# Altium project STM_System_Board.PrjPCB (part 5 of 6)

## Sheet Ethernet.SchDoc
size 420 x 297 mm; Author: G.Kasprowicz, P. Kulik; CompanyName: WUT ISE; DrawnBy: G.Kasprowicz, P. Kulik; Organization: WUT ISE; DocumentNumber: 2; SheetNumber: 2; ModifiedBy: -; CheckedDate: -; Title2: Ethernet; Designer: G.Kasprowicz, P. Kulik; ModifiedDate: -; ProjectName: Sensor Box
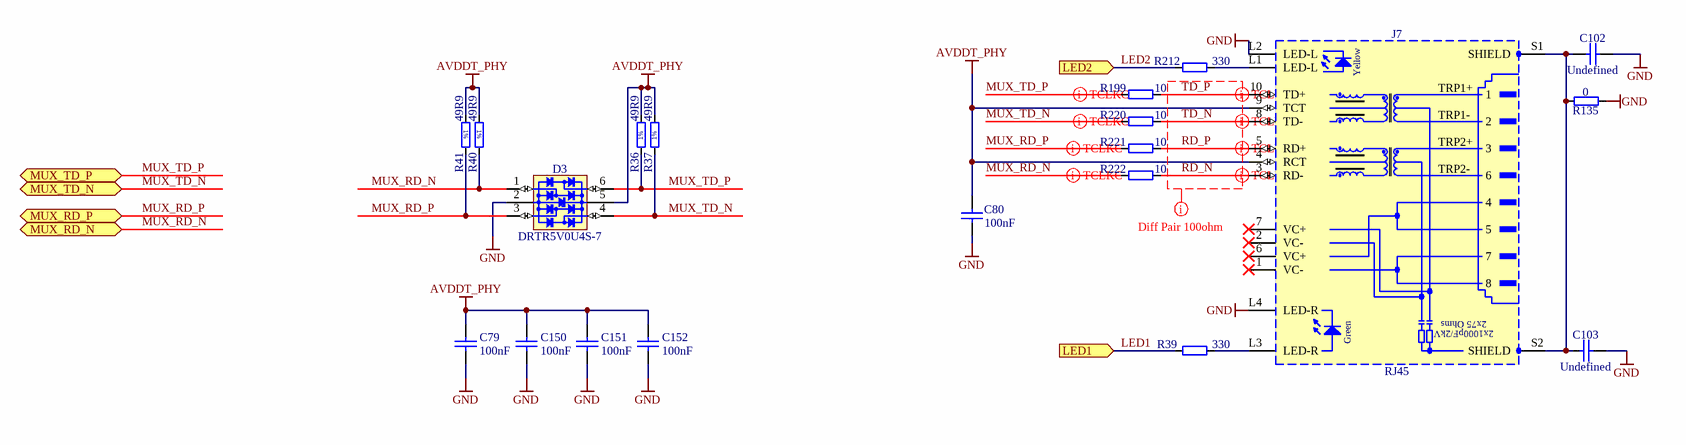
[diagram p9: Ethernet.SchDoc]

### Parts
C79  100nF  [CAPC1005X55N]
C80  100nF  [CAPC1005X55N]
C102  Undefined  [CAPC2012X135N]
C103  Undefined  [CAPC2012X135N]
C150  100nF  [CAPC1005X55N]
C151  100nF  [CAPC1005X55N]
C152  100nF  [CAPC1005X55N]
D3  DRTR5V0U4S-7  [SOT65P210X110-6N]
J7  RJ45  [ABRACON_ARJM11C7-114-BA-EW2]
R36  49R9  [RESC1005X40N]
R37  49R9  [RESC1005X40N]
R39  330  [RESC1005X40N]
R40  49R9  [RESC1005X40N]
R41  49R9  [RESC1005X40N]
R135  0  [RESC1608X55N]
R199  10  [RESC1005X40N]
R212  330  [RESC1005X40N]
R220  10  [RESC1005X40N]
R221  10  [RESC1005X40N]
R222  10  [RESC1005X40N]

### Ports
LED1 (in), LED2 (in), MUX_RD_N (bidir), MUX_RD_P (bidir), MUX_TD_N (bidir), MUX_TD_P (bidir)

### Nets
AVDDT_PHY: C79.1 C80.2 C150.1 C151.1 C152.1 D3.5(VBUS) J7.4(RCT) J7.9(TCT) R36.2 R37.2 R40.1 R41.1
GND: C79.2 C80.1 C102.2 C103.2 C150.2 C151.2 C152.2 D3.2(GND) J7.L2(LED-L) J7.L4(LED-R) R135.1
LED1: R39.1 ; port LED1
LED2: R212.1 ; port LED2
MUX_RD_N: D3.1(I/O1) R40.2 R222.1 ; port MUX_RD_N
MUX_RD_P: D3.3(I/O2) R41.2 R221.1 ; port MUX_RD_P
MUX_TD_N: D3.4(I/O3) R37.1 R220.1 ; port MUX_TD_N
MUX_TD_P: D3.6(I/O4) R36.1 R199.1 ; port MUX_TD_P
RD_N: J7.3(RD-) R222.2
RD_P: J7.5(RD+) R221.2
TD_N: J7.8(TD-) R220.2
TD_P: J7.10(TD+) R199.2
NetC102_1: C102.1 C103.1 J7.S1(SHIELD) J7.S2(SHIELD) R135.2
NetJ7_L1: J7.L1(LED-L) R212.2
NetJ7_L3: J7.L3(LED-R) R39.2

Not connected (* = marked no-connect by the designer): J7 1(VC-)* 2(VC-)* 6(VC+)* 7(VC+)*

### Layout directives
differential pair: MUX_RD_N, MUX_RD_P, MUX_TD_N, MUX_TD_P, RD_N, RD_P, TD_N, TD_P
mark named Diff Pair 100ohm: RD_N, RD_P, TD_N, TD_P

### Notes on the sheet
- Project/Equipment
- Document
- Designer
- Drawn by
- Check.by
- Copyright WUT =Copy(CurrentDate,7,4)
  This document describes Open Hardware and is licensed under the CERN-OHL-W v2
  You may redistribute and modify this documentation and make products using it under the terms of the CERN-OHL-W v2 (https:/cern.ch/cern-ohl). This documentation is distributed WITHOUT ANY EXPRESS OR IMPLIED WARRANTY, INCLUDING OF MERCHANTABILITY, SATISFACTORY QUALITY AND FITNESS FOR A PARTICULAR PURPOSE. Please see the CERN-OHL-W v2 for applicable conditions.
  Source location: =SourceLocation
  As per CERN-OHL-W v2 section 4, should You produce hardware based on these sources, You must maintain the Source Location visible on the silkscreen or top copper for a =Title1 PCB or other product you make using this documentation.
- Contact:
- File
- Last Mod.
- Print Date
- Sheet
- Size
- A3
- of
- Rev
- (in symbol CON_ETH_POE_ARJM11C7) Yellow; TRP1+; TRP1-; TRP2+; TRP2-; 2x75 Ohms; Green; 2x1000pF/2kV
- (in symbol R0402_49R9_1%_0.0625W_100PPM) 1%

### Library data of the parts
C79 C80 C150-C152 = CC0402_100NF_16V_10%_X5R: Non-polarised capacitor; Part Description: SMD Multilayer Chip Ceramic Capacitor; Manufacturer: GENERIC; Manufacturer1 Part Number: GRM155R61C104KA88D; Voltage: 16V; TC: X5R; Tolerance: ±10%; Part Number: CC0402_100NF_16V_10%_X5R; Component Kind: Standard; Component Type: Standard; Pin Count: 2; Value: 100nF; Status: None; Manufacturer Part Number: CC0402_100NF_16V_10%_X5R; Case: 0402; Mounted: Yes; Socket: No; SMD: Yes; Manufacturer1 Example: MURATA; Manufacturer1 ComponentHeight: 0.55mm; HelpURL: \\cern.ch\dfs\Applications\Altium\Datasheets\CC0402_X5R_MURATA_GRM.pdf; Author: CERN DEM JLC; CreateDate: 10.12.2013; LatestRevisionDate: 10.12.2013; Sense: No
C102 C103 = CC0805_NO-VALUE: Non-polarised capacitor; Part Description: Reserved Footprint For 0805(2012) Chip Ceramic Capacitor; Mounted: No; Part Number: CC0805_NO-VALUE; Component Kind: Standard; Component Type: Standard; Pin Count: 2; Value: Undefined; Status: None; Manufacturer: Undefined; Manufacturer Part Number: CC0805_NO-VALUE; Case: 0805; Socket: No; SMD: Yes; Sense: No; Manufacturer1 ComponentHeight: 1.35mm; HelpURL: Undefined; Author: CERN DEM JLC; CreateDate: 10.12.2008; LatestRevisionDate: 11.09.2013
D3 = D_TVS_DRTR5V0U4S-7: Integrated Quad Ultra-Low Capacitance ESD Protection; Part Description: Integrated Quad Ultra-Low Capacitance ESD (±8kV) Protection; Manufacturer: DIODES; PressFit: No; Bonding: No; Status Comment: Active; Part Number: DRTR5V0U4S-7; Component Kind: Standard; Component Type: Standard; Device: DRTR5V0U4S-7; PackageDescription: SOT363, SC70-6, 0.65mm Pitch; 6 Pin, 1.25mm W X 2.00mm L X 1.10mm H body, IPC Medium Density; Status: Active; Manufacturer Part Number: DRTR5V0U4S-7; Pin Count: 6; Case: SOT363; Mounted: Yes; Socket: No; SMD: Yes; Sense: No; ComponentHeight: 1.1mm; HelpURL: \\cern.ch\dfs\Applications\Altium\Datasheets\PRTR5V0U4Y.pdf; Author: GK; CreateDate: 24.01.2017; LatestRevisionDate: 14.09.2020
J7 = CON_ETH_POE_ARJM11C7: MagJack 10/100BaseT, PoE+, 1X1, OG/Y, -40 to 85*C, Tab Up, RoHS; Part Number: ARJM11C7-114-BA-EW2; Part Description: 1 Port, Orange Green/Yellow LEDs, RJ45 10/100BaseT, PoE, Ethernet MagJack® Connector Module; Manufacturer: Abracon; PressFit: No; Component Kind: Standard; Component Type: Standard; Pin Count: 18; Family: RJ45; Mounted: Yes; Socket: No; SMD: No; Sense: No; Status: None; Manufacturer Part Number: ARJM11C7-114-BA-EW2; ComponentHeight: 13.61mm; HelpURL: \\cern.ch\dfs\Applications\Altium\Datasheets\BELFUSE_0826-1X1T-GJ-F.pdf; Author: GK; CreateDate: 05.11.2012; LatestRevisionDate: 05.11.2012
R36 R37 R40 R41 = R0402_49R9_1%_0.0625W_100PPM: Resistor - 1%; Part Description: General Purpose Thick Film Chip Resistor; Manufacturer: GENERIC; Manufacturer1 Part Number: 232270674999L or RC0402FR-0749R9L; TC: ±100ppm/°C; Table: Resistors SMD; Part Number: R0402_49R9_1%_0.0625W_100PPM; Component Kind: Standard; Component Type: Standard; Pin Count: 2; Value: 49R9; Status: Not recommended; Power: 0.0625W; Tolerance: ±1%; Manufacturer Part Number: R0402_49R9_1%_0.0625W_100PPM; Case: 0402; Mounted: Yes; Socket: No; SMD: Yes; Manufacturer1 Example: YAGEO PHYCOMP; Manufacturer1 ComponentHeight: 0.4mm; HelpURL: \\cern.ch\dfs\Applications\Altium\Datasheets\R0402_Phycomp_RC0402.pdf; Author: CERN DEM JLC; CreateDate: 2012-10-24; LatestRevisionDate: 2012-10-24
R39 R212 = R0402_330R_1%_0.0625W_100PPM: Resistor - 1%; Part Description: General Purpose Thick Film Chip Resistor; Manufacturer: GENERIC; Manufacturer1 Part Number: 232270673301L; TC: ±100ppm/°C; PressFit: No; Part Number: R0402_330R_1%_0.0625W_100PPM; Component Kind: Standard; Component Type: Standard; Pin Count: 2; Value: 330; Status: Not Recommended; Power: 0.0625W; Tolerance: ±1%; Manufacturer Part Number: R0402_330R_1%_0.0625W_100PPM; Case: 0402; Mounted: Yes; Sense: No; Socket: No; SMD: Yes; Manufacturer1 Example: YAGEO PHYCOMP; Manufacturer1 ComponentHeight: 0.4mm; HelpURL: \\cern.ch\dfs\Applications\Altium\Datasheets\R0402_Phycomp_RC0402.pdf; Author: CERN DEM JLC; CreateDate: 03.12.2007; LatestRevisionDate: 17.10.2012
R135 = R0603_0R_JUMPER: Resistor; Part Description: 1A (0.05R Max DC Resistance) Zero Ohm Jumper; Manufacturer: GENERIC; Manufacturer1 Part Number: NRC06Z0; PressFit: No; Part Number: R0603_0R_JUMPER; Component Kind: Standard; Component Type: Standard; Pin Count: 2; Value: 0; Status: Preferred; Manufacturer Part Number: R0603_0R_JUMPER; Case: 0603; Mounted: Yes; Sense: No; Socket: No; SMD: Yes; Manufacturer1 Example: NIC COMPONENT; Manufacturer1 ComponentHeight: 0.55mm; HelpURL: \\cern.ch\dfs\Applications\Altium\Datasheets\R0603_NIC_NRC.pdf; Author: CERN DEM JLC; CreateDate: 03.12.2007; LatestRevisionDate: 13.03.2008
R199 R220-R222 = R0402_10R_1%_0.0625W_200PPM: Resistor - 1%; Part Description: General Purpose Thick Film Chip Resistor; Manufacturer: GENERIC; Manufacturer1 Part Number: 232270671009L; TC: ±200ppm/°C; PressFit: No; Part Number: R0402_10R_1%_0.0625W_200PPM; Component Kind: Standard; Component Type: Standard; Pin Count: 2; Value: 10; Status: Not Recommended; Power: 0.0625W; Tolerance: ±1%; Manufacturer Part Number: R0402_10R_1%_0.0625W_200PPM; Case: 0402; Mounted: Yes; Sense: No; Socket: No; SMD: Yes; Manufacturer1 Example: YAGEO PHYCOMP; Manufacturer1 ComponentHeight: 0.4mm; HelpURL: \\cern.ch\dfs\Applications\Altium\Datasheets\R0402_Phycomp_RC0402.pdf; Author: CERN DEM JLC; CreateDate: 24.06.2009; LatestRevisionDate: 17.10.2012

## Sheet ST_SYS_Board_Config.schdoc
size 420 x 297 mm; EDA_Number: ARTIQ; Author: G.Kasprowicz; CompanyName: WUT ISE; DrawnBy: G.Kasprowicz; Organization: WUT ISE; DocumentNumber: 12; SheetNumber: 12; ModifiedBy: -; CheckedDate: -; Title2: Configuration; Designer: G.Kasprowicz; ModifiedDate: -; ProjectName: Sensor Box
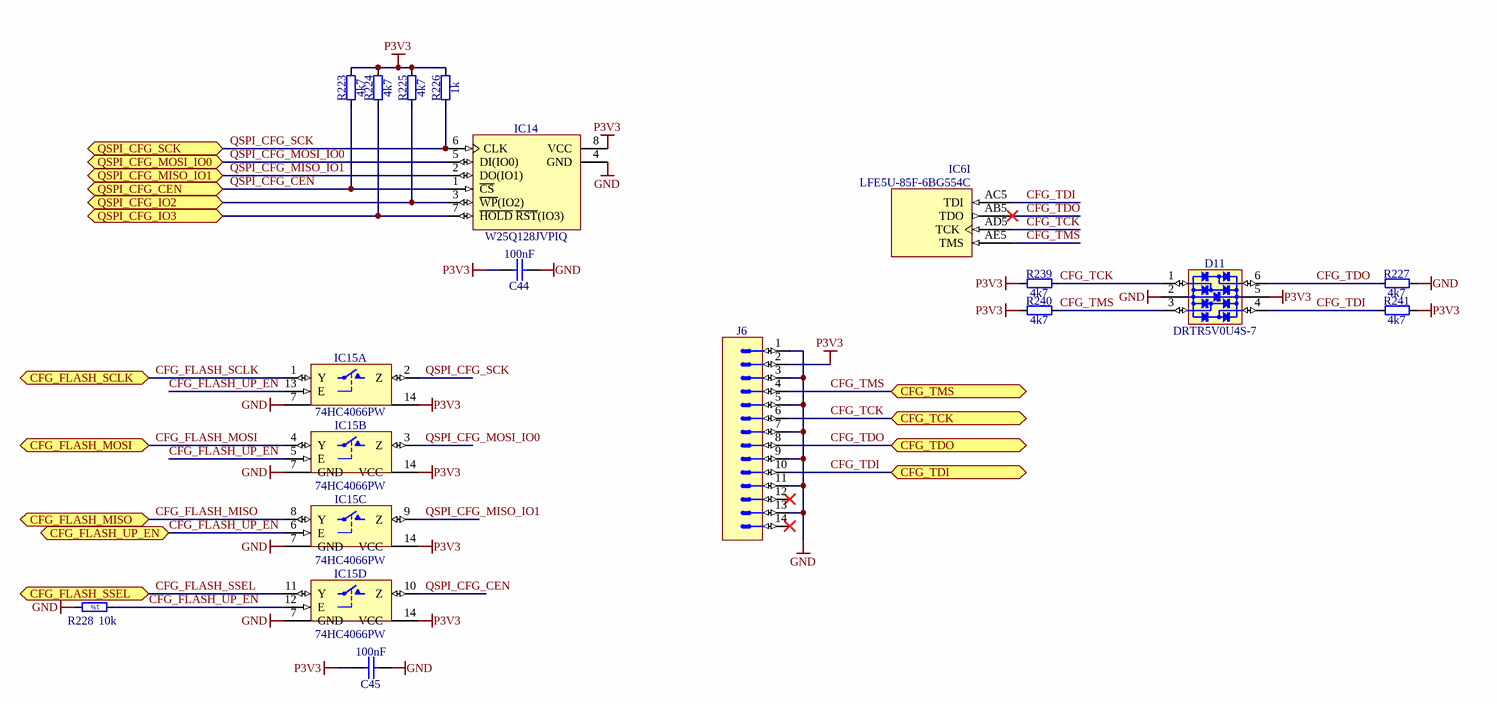
[diagram p10: ST_SYS_Board_Config.schdoc]

### Parts
C44  100nF  [CAPC1005X55N]
C45  100nF  [CAPC1005X55N]
D11  DRTR5V0U4S-7  [SOT65P210X110-6N]
IC6  LFE5U-85F-6BG554C  [BGA554C80P26X26_2300X2300X176]  (part I of 15)
IC14  W25Q128JVPIQ  [SON127P600X500X80-9N-R345X435]
IC15  74HC4066PW  [SOP65P640X110-14N]  (parts A,B,C,D of 4)
J6  Milli-Grid™  [MOLEX_87832-1420]  (value not drawn)
R223  4k7  [RESC1005X40N]
R224  4k7  [RESC1005X40N]
R225  4k7  [RESC1005X40N]
R226  1k  [RESC1005X40N]
R227  4k7  [RESC1005X40N]
R228  10k  [RESC1005X40N]
R239  4k7  [RESC1005X40N]
R240  4k7  [RESC1005X40N]
R241  4k7  [RESC1005X40N]

### Ports
CFG_FLASH_MISO (bidir), CFG_FLASH_MOSI (bidir), CFG_FLASH_SCLK (bidir), CFG_FLASH_SSEL (bidir), CFG_FLASH_UP_EN (bidir), CFG_TCK (bidir), CFG_TDI (bidir), CFG_TDO (bidir), CFG_TMS (bidir), QSPI_CFG_CEN (bidir), QSPI_CFG_IO2 (bidir), QSPI_CFG_IO3 (bidir), QSPI_CFG_MISO_IO1 (bidir), QSPI_CFG_MOSI_IO0 (bidir), QSPI_CFG_SCK (bidir)

### Nets
GND: C44.1 C45.1 D11.2(GND) IC14.4(GND) IC15.7(GND) J6.1 J6.3 J6.5 J6.7 J6.9 J6.11 J6.13 R227.2 R228.2
P3V3: C44.2 C45.2 D11.5(VBUS) IC14.8(VCC) IC15.14(VCC) J6.2 R223.2 R224.2 R225.2 R226.2 R239.1 R240.1 R241.2
CFG_FLASH_MISO: IC15.8(Y) ; port CFG_FLASH_MISO
CFG_FLASH_MOSI: IC15.4(Y) ; port CFG_FLASH_MOSI
CFG_FLASH_SCLK: IC15.1(Y) ; port CFG_FLASH_SCLK
CFG_FLASH_SSEL: IC15.11(Y) ; port CFG_FLASH_SSEL
CFG_FLASH_UP_EN: IC15.5(E) IC15.6(E) IC15.12(E) IC15.13(E) R228.1 ; port CFG_FLASH_UP_EN
CFG_TCK: D11.1(I/O1) IC6.AD5(TCK) J6.6 R239.2 ; port CFG_TCK
CFG_TDI: D11.4(I/O3) IC6.AC5(TDI) J6.10 R241.1 ; port CFG_TDI
CFG_TDO: D11.6(I/O4) IC6.AB5(TDO) J6.8 R227.1 ; port CFG_TDO
CFG_TMS: D11.3(I/O2) IC6.AE5(TMS) J6.4 R240.2 ; port CFG_TMS
QSPI_CFG_CEN: IC14.1(~{CS}) IC15.10(Z) R223.1 ; port QSPI_CFG_CEN
QSPI_CFG_IO2: IC14.3(~{WP}(IO2)) R225.1 ; port QSPI_CFG_IO2
QSPI_CFG_IO3: IC14.7(~{HOLD}_~{RST}(IO3)) R224.1 ; port QSPI_CFG_IO3
QSPI_CFG_MISO_IO1: IC14.2(DO(IO1)) IC15.9(Z) ; port QSPI_CFG_MISO_IO1
QSPI_CFG_MOSI_IO0: IC14.5(DI(IO0)) IC15.3(Z) ; port QSPI_CFG_MOSI_IO0
QSPI_CFG_SCK: IC14.6(CLK) IC15.2(Z) R226.1 ; port QSPI_CFG_SCK

Not connected (* = marked no-connect by the designer): J6 12* 14*

### Notes on the sheet
- Project/Equipment
- Document
- Designer
- Drawn by
- Check.by
- Copyright WUT =Copy(CurrentDate,7,4)
  This document describes Open Hardware and is licensed under the CERN-OHL-W v2
  You may redistribute and modify this documentation and make products using it under the terms of the CERN-OHL-W v2 (https:/cern.ch/cern-ohl). This documentation is distributed WITHOUT ANY EXPRESS OR IMPLIED WARRANTY, INCLUDING OF MERCHANTABILITY, SATISFACTORY QUALITY AND FITNESS FOR A PARTICULAR PURPOSE. Please see the CERN-OHL-W v2 for applicable conditions.
  Source location: =SourceLocation
  As per CERN-OHL-W v2 section 4, should You produce hardware based on these sources, You must maintain the Source Location visible on the silkscreen or top copper for a =Title1 PCB or other product you make using this documentation.
- Contact:
- File
- Last Mod.
- Print Date
- Sheet
- Size
- A3
- of
- Rev
- (in symbol R0402_10K_1%_0.0625W_100PPM) 1%

### Library data of the parts
C44 C45 = CC0402_100NF_16V_10%_X5R: as C79 on sheet Ethernet; Part Number: CC0402_100NF_16V_10%_X5R; Component Kind: Standard; Component Type: Standard; Pin Count: 2; Value: 100nF; Status: None; Manufacturer Part Number: CC0402_100NF_16V_10%_X5R; Case: 0402; Mounted: Yes; Socket: No; SMD: Yes; Sense: No; Manufacturer1 Example: MURATA; Manufacturer1 ComponentHeight: 0.55mm; HelpURL: \\cern.ch\dfs\Applications\Altium\Datasheets\CC0402_X5R_MURATA_GRM.pdf; Author: CERN DEM JLC; CreateDate: 10.12.2013; LatestRevisionDate: 10.12.2013
D11 = D_TVS_DRTR5V0U4S-7: as D3 on sheet Ethernet; Part Number: DRTR5V0U4S-7; Component Kind: Standard; Component Type: Standard; Device: DRTR5V0U4S-7; PackageDescription: SOT363, SC70-6, 0.65mm Pitch; 6 Pin, 1.25mm W X 2.00mm L X 1.10mm H body, IPC Medium Density; Status: Active; Manufacturer Part Number: DRTR5V0U4S-7; Pin Count: 6; Case: SOT363; Mounted: Yes; Socket: No; SMD: Yes; Sense: No; ComponentHeight: 1.1mm; HelpURL: \\cern.ch\dfs\Applications\Altium\Datasheets\PRTR5V0U4Y.pdf; Author: GK; CreateDate: 24.01.2017; LatestRevisionDate: 14.09.2020
IC6 = LFE5U-85F-6BG554C: Part Description: FPGA LatticeECP5 Family 84000 Cells 40nm Technology 1.1V 554-Pin CABGA Tray; Manufacturer: LATTICE SEMICONDUCTOR; PressFit: No; Bonding: No; Part Number: LFE5U-85F-6BG554C; Component Kind: Standard; Component Type: Standard; Device: LFE5U-85F-6BG554C; PackageDescription: BGA, 0.80mm Pitch, Square; 554Pin, 26 Columns X 26 Rows, 23mm X 23mm X 1.76mm H; Manufacturer Part Number: LFE5U-85F-6BG554C; Pin Count: 554; Case: BGA554; Mounted: Yes; Socket: No; SMD: Yes; Sense: No; ComponentHeight: 1.76mm; HelpURL: \\cern.ch\dfs\Applications\Altium\Datasheets\LFE5U-85F-6BG554C.pdf; ComponentLink1URL: \\cern.ch\dfs\Applications\Altium\Datasheets\LATTICE_Package.pdf; ComponentLink1Description: Package Drawing; ComponentLink2URL: \\cern.ch\dfs\Applications\Altium\Datasheets\LFE5U-85F-6BG554C_Pinout.pdf; ComponentLink2Description: Pinout; Author: CERN DEM HF; CreateDate: 18.02.2022; LatestRevisionDate: 18.02.2022
IC14 = W25Q128JVPIQ: 128M-bit Serial Flash Memory with uniform 4KB sectors and Dual/Quad SPI and QPI; Manufacturer: WINBOND; PressFit: No; Bonding: No; Part Number: W25Q128JVPIQ; Component Kind: Standard; Component Type: Standard; Device: W25Q128JVPIQ; PackageDescription: SON, 1.27mm Pitch; 8 Pin, 6.00mm W X 5.00mm L X 0.8mm H body (w/Thermal Tab 3.45mm x 4.35mm); Part Description: 128M-bit Serial Flash Memory with uniform 4KB sectors and Dual/Quad SPI and QPI; Manufacturer Part Number: W25Q128JVPIQ; Pin Count: 9; Case: SON8; Mounted: Yes; Socket: No; SMD: Yes; Sense: No; ComponentHeight: 0.8mm; HelpURL: \\cern.ch\dfs\Applications\Altium\Datasheets\W25Q128JVPIQ.pdf; Author: CERN DEM BC; CreateDate: 24.01.2019; LatestRevisionDate: 24.01.2019
IC15 = 74HC4066PW: Part Description: Quad Single-Pole Single-Throw Analog Switch; Manufacturer: NXP SEMICONDUCTORS; PressFit: No; Bonding: No; Table: Standard Logic; Part Number: 74HC4066PW; Component Kind: Standard; Component Type: Standard; Device: 74HC4066PW; PackageDescription: SOP, 14-Leads, Body 4.4x5mm (max), Pitch 0.65mm, IPC Medium Density; Manufacturer Part Number: 74HC4066PW; Pin Count: 14; Case: TSSOP14; Mounted: Yes; Socket: No; SMD: Yes; ComponentHeight: 1.1mm; Author: CERN DEM JLC; HelpURL: \\cern.ch\dfs\Applications\Altium\Datasheets\74HC4066PW.pdf; CreateDate: 2014-11-19; LatestRevisionDate: 2014-11-19
J6 = MOLEX_87832-1420: Connector 14 Male; Part Description: 2.00mm (.079") Pitch Milli-Grid™ Header, Surface Mount, Vertical, Shrouded, 14 Circuits,with Locking Windows and Centre Polarization Slot, PCB Locator; Manufacturer: MOLEX; PressFit: No; Part Number: MOLEX_87832-1420; Component Kind: Standard; Component Type: Standard; Pin Count: 14; Family: Milli-Grid™; Mounted: Yes; Socket: No; SMD: Yes; Sense: No; Status: None; Manufacturer Part Number: 87832-1420; ComponentHeight: 7.6mm; HelpURL: \\cern.ch\dfs\Applications\Altium\Datasheets\MOLEX_87832-1420.pdf; Author: CERN DEM JLC; CreateDate: 09.09.2008; LatestRevisionDate: 09.09.2008
R223-R225 R227 R239-R241 = R0402_4k7_1%_0.0625W_100PPM: Resistor - 1%; Part Description: General Purpose Thick Film Chip Resistor; Manufacturer: GENERIC; Manufacturer1 Part Number: 232270674702L; TC: ±100ppm/°C; PressFit: No; Part Number: R0402_4K7_1%_0.0625W_100PPM; Component Kind: Standard; Component Type: Standard; Pin Count: 2; Value: 4k7; Status: Not Recommended; Power: 0.0625W; Tolerance: ±1%; Manufacturer Part Number: R0402_4K7_1%_0.0625W_100PPM; Case: 0402; Mounted: Yes; Sense: No; Socket: No; SMD: Yes; Manufacturer1 Example: YAGEO PHYCOMP; Manufacturer1 ComponentHeight: 0.4mm; HelpURL: \\cern.ch\dfs\Applications\Altium\Datasheets\R0402_Phycomp_RC0402.pdf; Author: CERN DEM JLC; CreateDate: 03.12.2007; LatestRevisionDate: 17.10.2012
R226 = R0402_1k_1%_0.0625W_100PPM: Resistor - 1%; Part Description: General Purpose Thick Film Chip Resistor; Manufacturer: GENERIC; Manufacturer1 Part Number: 232270671002L; TC: ±100ppm/°C; PressFit: No; Part Number: R0402_1K_1%_0.0625W_100PPM; Component Kind: Standard; Component Type: Standard; Pin Count: 2; Value: 1k; Status: Not Recommended; Power: 0.0625W; Tolerance: ±1%; Manufacturer Part Number: R0402_1K_1%_0.0625W_100PPM; Case: 0402; Mounted: Yes; Sense: No; Socket: No; SMD: Yes; Manufacturer1 Example: YAGEO PHYCOMP; Manufacturer1 ComponentHeight: 0.4mm; HelpURL: \\cern.ch\dfs\Applications\Altium\Datasheets\R0402_Phycomp_RC0402.pdf; Author: CERN DEM JLC; CreateDate: 03.12.2007; LatestRevisionDate: 17.10.2012
R228 = R0402_10K_1%_0.0625W_100PPM: Resistor - 1%; Part Description: General Purpose Thick Film Chip Resistor; Manufacturer: GENERIC; Manufacturer1 Part Number: 232270671003L; TC: ±100ppm/°C; Table: Resistors SMD; Part Number: R0402_10K_1%_0.0625W_100PPM; Component Kind: Standard; Component Type: Standard; Pin Count: 2; Value: 10k; Status: Not recommended; Power: 0.0625W; Tolerance: ±1%; Manufacturer Part Number: R0402_10K_1%_0.0625W_100PPM; Case: 0402; Mounted: Yes; Socket: No; SMD: Yes; Manufacturer1 Example: YAGEO PHYCOMP; Manufacturer1 ComponentHeight: 0.4mm; HelpURL: \\cern.ch\dfs\Applications\Altium\Datasheets\R0402_Phycomp_RC0402.pdf; Author: CERN DEM JLC; CreateDate: 2007-12-03; LatestRevisionDate: 2012-10-17

## Sheet ST_SYS_Board_Clocking.schdoc
size 420 x 297 mm; EDA_Number: ARTIQ; Author: G.Kasprowicz; CompanyName: WUT ISE; DrawnBy: G.Kasprowicz; Organization: WUT ISE; DocumentNumber: 13; SheetNumber: 13; ModifiedBy: -; CheckedDate: -; Title2: Clock distribution; Designer: G.Kasprowicz; ModifiedDate: -; ProjectName: Sensor Box
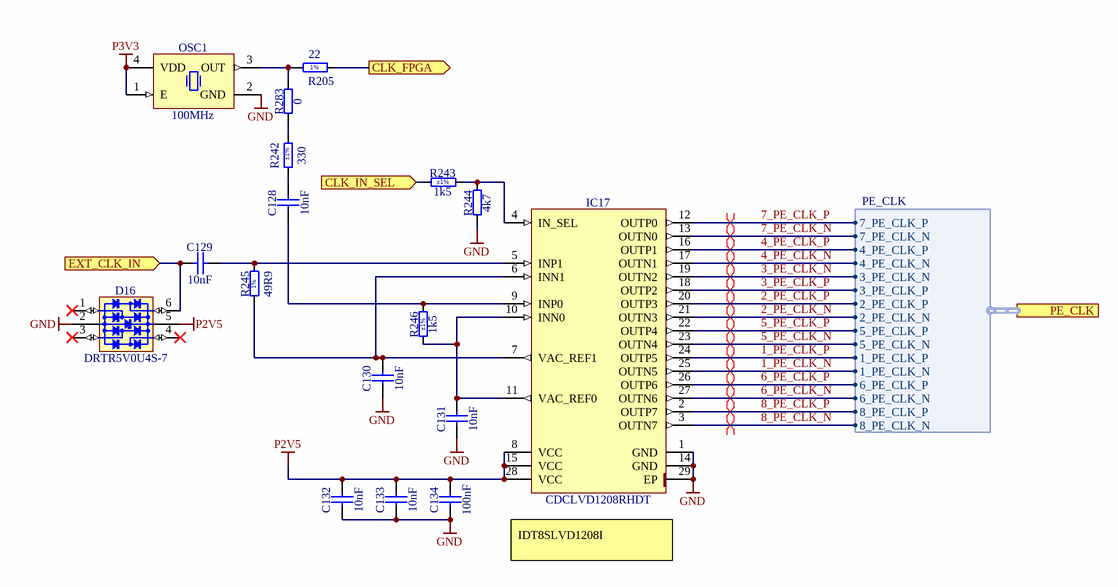
[diagram p11: ST_SYS_Board_Clocking.schdoc]

### Parts
C128  10nF  [CAPC0603X33N]
C129  10nF  [CAPC0603X33N]
C130  10nF  [CAPC0603X33N]
C131  10nF  [CAPC0603X33N]
C132  10nF  [CAPC0603X33N]
C133  10nF  [CAPC0603X33N]
C134  100nF  [CAPC1005X55N]
D16  DRTR5V0U4S-7  [SOT65P210X110-6N]
IC17  CDCLVD1208RHDT  [QFN50P500X500X100-29N-S325]
OSC1  100MHz  [OSC_ECS_ECS-3953M]
R205  22  [RESC1005X40N]
R242  330  Tolerance: ±1%  [RESC1005X40N]
R243  1k5  Tolerance: ±1%  [RESC1005X40N]
R244  4k7  [RESC1005X40N]
R245  49R9  [RESC1005X40N]
R246  1k5  Tolerance: ±1%  [RESC1005X40N]
R283  0  [RESC1005X40N]

### Ports
CLK_FPGA (out), CLK_IN_SEL (in), EXT_CLK_IN (in), PE_CLK (harness PE_CLK)

### Harnesses
PE_CLK: 1_PE_CLK_P, 1_PE_CLK_N, 2_PE_CLK_P, 2_PE_CLK_N, 3_PE_CLK_P, 3_PE_CLK_N, 4_PE_CLK_P, 4_PE_CLK_N, 5_PE_CLK_P, 5_PE_CLK_N, 6_PE_CLK_P, 6_PE_CLK_N, 7_PE_CLK_P, 7_PE_CLK_N, 8_PE_CLK_P, 8_PE_CLK_N

### Nets
GND: C130.1 C131.1 C132.1 C133.1 C134.1 D16.2(GND) IC17.1(GND) IC17.14(GND) IC17.29(EP) OSC1.2(GND) R244.1
P2V5: C132.2 C133.2 C134.2 D16.5(VBUS) IC17.8(VCC) IC17.15(VCC) IC17.28(VCC)
P3V3: OSC1.1(E) OSC1.4(VDD)
1_PE_CLK_N: IC17.25(OUTN5) ; port PE_CLK.1_PE_CLK_N
1_PE_CLK_P: IC17.24(OUTP5) ; port PE_CLK.1_PE_CLK_P
2_PE_CLK_N: IC17.21(OUTN3) ; port PE_CLK.2_PE_CLK_N
2_PE_CLK_P: IC17.20(OUTP3) ; port PE_CLK.2_PE_CLK_P
3_PE_CLK_N: IC17.19(OUTN2) ; port PE_CLK.3_PE_CLK_N
3_PE_CLK_P: IC17.18(OUTP2) ; port PE_CLK.3_PE_CLK_P
4_PE_CLK_N: IC17.17(OUTN1) ; port PE_CLK.4_PE_CLK_N
4_PE_CLK_P: IC17.16(OUTP1) ; port PE_CLK.4_PE_CLK_P
5_PE_CLK_N: IC17.23(OUTN4) ; port PE_CLK.5_PE_CLK_N
5_PE_CLK_P: IC17.22(OUTP4) ; port PE_CLK.5_PE_CLK_P
6_PE_CLK_N: IC17.27(OUTN6) ; port PE_CLK.6_PE_CLK_N
6_PE_CLK_P: IC17.26(OUTP6) ; port PE_CLK.6_PE_CLK_P
7_PE_CLK_N: IC17.13(OUTN0) ; port PE_CLK.7_PE_CLK_N
7_PE_CLK_P: IC17.12(OUTP0) ; port PE_CLK.7_PE_CLK_P
8_PE_CLK_N: IC17.3(OUTN7) ; port PE_CLK.8_PE_CLK_N
8_PE_CLK_P: IC17.2(OUTP7) ; port PE_CLK.8_PE_CLK_P
CLK_FPGA: R205.2 ; port CLK_FPGA
CLK_IN_SEL: R243.1 ; port CLK_IN_SEL
NetC128_1: C128.1 IC17.9(INP0) R246.2
NetC128_2: C128.2 R242.1
NetC129_1: C129.1 D16.6(I/O4) ; port EXT_CLK_IN
NetC129_2: C129.2 IC17.5(INP1) R245.2
NetC130_2: C130.2 IC17.6(INN1) IC17.7(VAC_REF1) R245.1
NetC131_2: C131.2 IC17.10(INN0) IC17.11(VAC_REF0) R246.1
NetIC17_4: IC17.4(IN_SEL) R243.2 R244.2
NetOSC1_3: OSC1.3(OUT) R205.1 R283.2
NetR242_2: R242.2 R283.1

Not connected (* = marked no-connect by the designer): D16 1(I/O1)* 3(I/O2)* 4(I/O3)*

### Layout directives
differential pair; differential pair class PE_CLK: 1_PE_CLK_N, 1_PE_CLK_P, 2_PE_CLK_N, 2_PE_CLK_P, 3_PE_CLK_N, 3_PE_CLK_P, 4_PE_CLK_N, 4_PE_CLK_P, 5_PE_CLK_N, 5_PE_CLK_P, 6_PE_CLK_N, 6_PE_CLK_P, 7_PE_CLK_N, 7_PE_CLK_P, 8_PE_CLK_N, 8_PE_CLK_P

### Notes on the sheet
- IDT8SLVD1208I
- Project/Equipment
- Document
- Designer
- Drawn by
- Check.by
- Copyright WUT =Copy(CurrentDate,7,4)
  This document describes Open Hardware and is licensed under the CERN-OHL-W v2
  You may redistribute and modify this documentation and make products using it under the terms of the CERN-OHL-W v2 (https:/cern.ch/cern-ohl). This documentation is distributed WITHOUT ANY EXPRESS OR IMPLIED WARRANTY, INCLUDING OF MERCHANTABILITY, SATISFACTORY QUALITY AND FITNESS FOR A PARTICULAR PURPOSE. Please see the CERN-OHL-W v2 for applicable conditions.
  Source location: =SourceLocation
  As per CERN-OHL-W v2 section 4, should You produce hardware based on these sources, You must maintain the Source Location visible on the silkscreen or top copper for a =Title1 PCB or other product you make using this documentation.
- Contact:
- File
- Last Mod.
- Print Date
- Sheet
- Size
- A3
- of
- Rev
- (in symbol R0402_22R_1%_0.0625W_100PPM) 1%
- (in symbol R0402_49R9_1%_0.0625W_100PPM) 1%

### Library data of the parts
C128-C133 = CC0201_10NF_10V_10%_X5R: Non-polarised capacitor; Part Description: SMD Multilayer Chip Ceramic Capacitor; Manufacturer: GENERIC; Manufacturer1 Part Number: 0201ZD103KAT2A; Voltage: 10V; TC: X5R; Tolerance: ±10%; Part Number: CC0201_10NF_10V_10%_X5R; Component Kind: Standard; Component Type: Standard; Pin Count: 2; Value: 10nF; Status: Not Recommended; Manufacturer Part Number: CC0201_10NF_10V_10%_X5R; Case: 0201; Mounted: Yes; Socket: No; SMD: Yes; Sense: No; Manufacturer1 Example: AVX; Manufacturer1 ComponentHeight: 0.33mm; HelpURL: \\cern.ch\dfs\Applications\Altium\Datasheets\CC0201_X5R_AVX.pdf; Author: CERN DEM JLC; CreateDate: 03.12.2007; LatestRevisionDate: 03.12.2007
C134 = CC0402_100NF_16V_10%_X5R: as C79 on sheet Ethernet; Part Number: CC0402_100NF_16V_10%_X5R; Component Kind: Standard; Component Type: Standard; Pin Count: 2; Value: 100nF; Status: None; Manufacturer Part Number: CC0402_100NF_16V_10%_X5R; Case: 0402; Mounted: Yes; Socket: No; SMD: Yes; Sense: No; Manufacturer1 Example: MURATA; Manufacturer1 ComponentHeight: 0.55mm; HelpURL: \\cern.ch\dfs\Applications\Altium\Datasheets\CC0402_X5R_MURATA_GRM.pdf; Author: CERN DEM JLC; CreateDate: 10.12.2013; LatestRevisionDate: 10.12.2013
D16 = D_TVS_DRTR5V0U4S-7: as D3 on sheet Ethernet; Part Number: DRTR5V0U4S-7; Component Kind: Standard; Component Type: Standard; Device: DRTR5V0U4S-7; PackageDescription: SOT363, SC70-6, 0.65mm Pitch; 6 Pin, 1.25mm W X 2.00mm L X 1.10mm H body, IPC Medium Density; Status: Active; Manufacturer Part Number: DRTR5V0U4S-7; Pin Count: 6; Case: SOT363; Mounted: Yes; Socket: No; SMD: Yes; Sense: No; ComponentHeight: 1.1mm; HelpURL: \\cern.ch\dfs\Applications\Altium\Datasheets\PRTR5V0U4Y.pdf; Author: GK; CreateDate: 24.01.2017; LatestRevisionDate: 14.09.2020
IC17 = CDCLVD1208RHDT: 2:8 Low Additive Jitter LVDS Buffer; Manufacturer: TEXAS INSTRUMENTS; PressFit: No; Bonding: No; Part Number: CDCLVD1208RHDT; Component Kind: Standard; Component Type: Standard; Device: CDCLVD1208RHDT; PackageDescription: QFN, 0.50mm Pitch, Square; 28 pin, 5.00mm L X 5.00mm W X 1.00mm H body (w/Thermal Tab 3.25 X 3.25mm), IPC Medium Density; Part Description: 2:8 Low Additive Jitter LVDS Buffer; Manufacturer Part Number: CDCLVD1208RHD; Pin Count: 29; Case: QFN28; Mounted: Yes; Socket: No; SMD: Yes; Sense: No; ComponentHeight: 1mm; HelpURL: \\cern.ch\dfs\Applications\Altium\Datasheets\CDCLVD1208RHDT.pdf; Author: CERN DEM JLC; CreateDate: 28.06.2012; LatestRevisionDate: 10.06.2022
OSC1 = OSC_100MHZ_ECS_ECS-3953M-1000-BN: Oscillator 4 pins 1=E/D 2=GND 3=OUT 4=VDD; Part Description: 3.3V, ±50ppm, 15pF, -40 to 85°C, Surface Mount Clock Oscillator (ECS-3951M/3953M-BN Series); Manufacturer: ECS; PressFit: No; Bonding: No; Part Number: OSC_100MHZ_ECS_ECS-3953M-1000-BN; Component Kind: Standard; Component Type: Standard; PackageDescription: SMD Oscillator, 4 pins, 7 x 5mm, ECS-3951/3953M-BN Series; Value: 100MHz; Manufacturer Part Number: ECS-3953M-1000-BN; Pin Count: 4; Mounted: Yes; Socket: No; SMD: Yes; Sense: No; ComponentHeight: 1.7mm; HelpURL: \\cern.ch\dfs\Applications\Altium\Datasheets\OSC_ECS_ECS-3953M-BN.pdf; Author: CERN DEM BC; CreateDate: 07.05.2020; LatestRevisionDate: 07.05.2020
R205 = R0402_22R_1%_0.0625W_100PPM: Resistor - 1%; Part Description: General Purpose Thick Film Chip Resistor; Manufacturer: GENERIC; Manufacturer1 Part Number: 232270672209L; TC: ±100ppm/°C; PressFit: No; Part Number: R0402_22R_1%_0.0625W_100PPM; Component Kind: Standard; Component Type: Standard; Pin Count: 2; Value: 22; Status: Not Recommended; Power: 0.0625W; Tolerance: ±1%; Manufacturer Part Number: R0402_22R_1%_0.0625W_100PPM; Case: 0402; Mounted: Yes; Socket: No; SMD: Yes; Manufacturer1 Example: YAGEO PHYCOMP; Manufacturer1 ComponentHeight: 0.4mm; HelpURL: \\cern.ch\dfs\Applications\Altium\Datasheets\R0402_Phycomp_RC0402.pdf; Author: CERN DEM JLC; CreateDate: 03.12.2007; LatestRevisionDate: 17.10.2012; Sense: No
R242 = R0402_330R_1%_0.0625W_100PPM: as R39 on sheet Ethernet; Part Number: R0402_330R_1%_0.0625W_100PPM; Component Kind: Standard; Component Type: Standard; Pin Count: 2; Value: 330; Status: Not Recommended; Power: 0.0625W; Manufacturer Part Number: R0402_330R_1%_0.0625W_100PPM; Case: 0402; Mounted: Yes; Sense: No; Socket: No; SMD: Yes; Manufacturer1 Example: YAGEO PHYCOMP; Manufacturer1 ComponentHeight: 0.4mm; HelpURL: \\cern.ch\dfs\Applications\Altium\Datasheets\R0402_Phycomp_RC0402.pdf; Author: CERN DEM JLC; CreateDate: 03.12.2007; LatestRevisionDate: 17.10.2012
R243 R246 = R0402_1K5_1%_0.0625W_100PPM: Resistor - 1%; Part Description: General Purpose Thick Film Chip Resistor; Manufacturer: GENERIC; Manufacturer1 Part Number: 232270671502L; TC: ±100ppm/°C; PressFit: No; Part Number: R0402_1K5_1%_0.0625W_100PPM; Component Kind: Standard; Component Type: Standard; Pin Count: 2; Value: 1k5; Status: Not Recommended; Power: 0.0625W; Manufacturer Part Number: R0402_1K5_1%_0.0625W_100PPM; Case: 0402; Mounted: Yes; Sense: No; Socket: No; SMD: Yes; Manufacturer1 Example: YAGEO PHYCOMP; Manufacturer1 ComponentHeight: 0.4mm; HelpURL: \\cern.ch\dfs\Applications\Altium\Datasheets\R0402_Phycomp_RC0402.pdf; Author: CERN DEM JLC; CreateDate: 03.12.2007; LatestRevisionDate: 17.10.2012
R244 = R0402_4k7_1%_0.0625W_100PPM: as R223-R225 on sheet ST_SYS_Board_Config; Part Number: R0402_4K7_1%_0.0625W_100PPM; Component Kind: Standard; Component Type: Standard; Pin Count: 2; Value: 4k7; Status: Not Recommended; Power: 0.0625W; Tolerance: ±1%; Manufacturer Part Number: R0402_4K7_1%_0.0625W_100PPM; Case: 0402; Mounted: Yes; Sense: No; Socket: No; SMD: Yes; Manufacturer1 Example: YAGEO PHYCOMP; Manufacturer1 ComponentHeight: 0.4mm; HelpURL: \\cern.ch\dfs\Applications\Altium\Datasheets\R0402_Phycomp_RC0402.pdf; Author: CERN DEM JLC; CreateDate: 03.12.2007; LatestRevisionDate: 17.10.2012
R245 = R0402_49R9_1%_0.0625W_100PPM: as R36 on sheet Ethernet; Part Number: R0402_49R9_1%_0.0625W_100PPM; Component Kind: Standard; Component Type: Standard; Pin Count: 2; Value: 49R9; Status: Not recommended; Power: 0.0625W; Tolerance: ±1%; Manufacturer Part Number: R0402_49R9_1%_0.0625W_100PPM; Case: 0402; Mounted: Yes; Socket: No; SMD: Yes; Manufacturer1 Example: YAGEO PHYCOMP; Manufacturer1 ComponentHeight: 0.4mm; HelpURL: \\cern.ch\dfs\Applications\Altium\Datasheets\R0402_Phycomp_RC0402.pdf; Author: CERN DEM JLC; CreateDate: 2012-10-24; LatestRevisionDate: 2012-10-24
R283 = R0402_0R_JUMPER: Resistor; Part Description: 1A (0.05R Max DC Resistance) Zero Ohm Jumper; Manufacturer: GENERIC; Manufacturer1 Part Number: 232270591001L; PressFit: No; Part Number: R0402_0R_JUMPER; Component Kind: Standard; Component Type: Standard; Pin Count: 2; Value: 0; Status: Not Recommended; Manufacturer Part Number: R0402_0R_JUMPER; Case: 0402; Mounted: Yes; Sense: No; Socket: No; SMD: Yes; Manufacturer1 Example: YAGEO PHYCOMP; Manufacturer1 ComponentHeight: 0.4mm; HelpURL: \\cern.ch\dfs\Applications\Altium\Datasheets\R0402_Phycomp_RC0402.pdf; Author: CERN DEM JLC; CreateDate: 03.12.2007; LatestRevisionDate: 17.10.2012

## Sheet RMII.SchDoc
size 420 x 297 mm; Author: G.Kasprowicz, P. Kulik; CompanyName: WUT ISE; DrawnBy: G.Kasprowicz, P. Kulik; Organization: WUT ISE; DocumentNumber: 2; SheetNumber: 2; ModifiedBy: -; CheckedDate: -; Title2: Ethernet; Designer: G.Kasprowicz, P. Kulik; ModifiedDate: -; ProjectName: Sensor Box
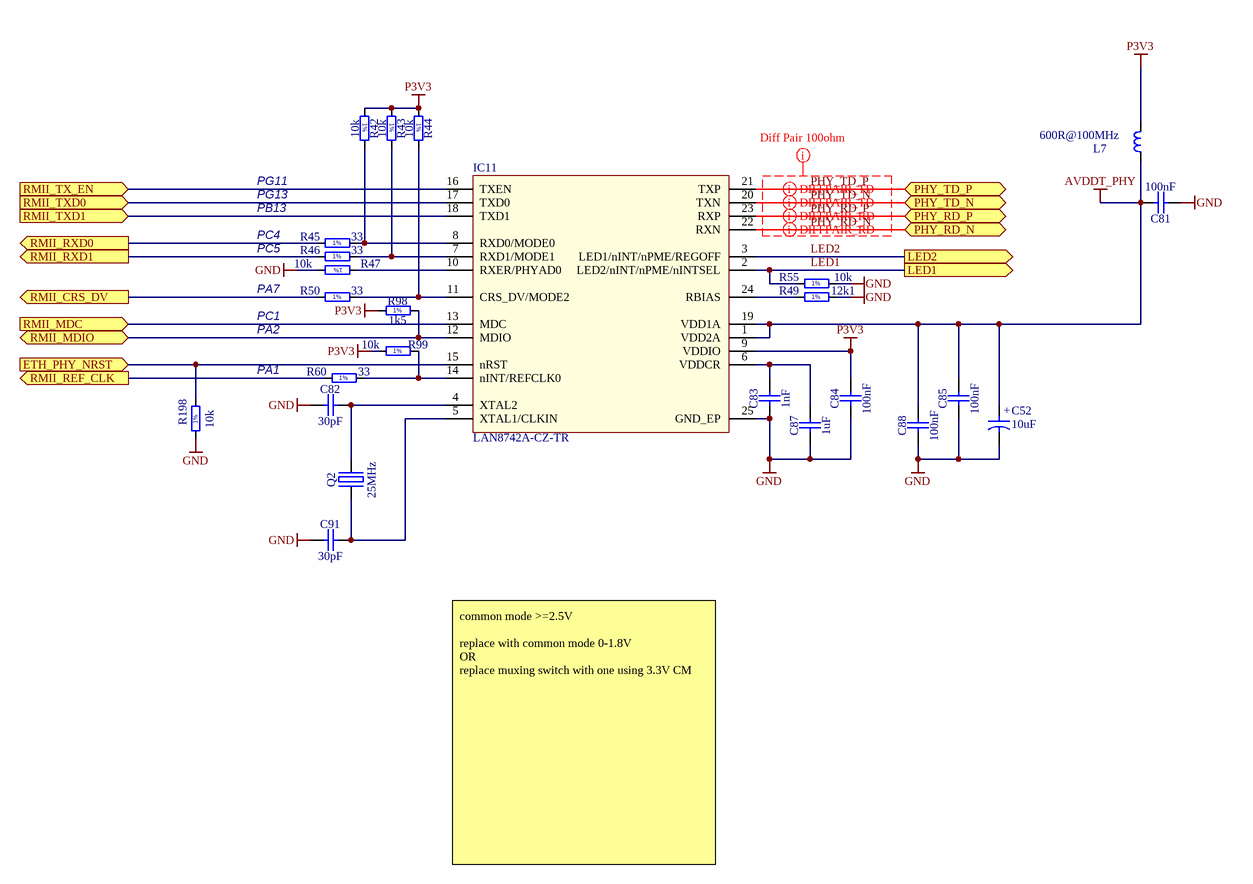
[diagram p12: RMII.SchDoc]

### Parts
C52  10uF  [CAPMP3216X180N]
C81  100nF  [CAPC1005X55N]
C82  30pF  [CAPC1005X55N]
C83  1nF  [CAPC1005X55N]
C84  100nF  [CAPC1005X55N]
C85  100nF  [CAPC1005X55N]
C87  1uF  [CAPC1608X87N]
C88  100nF  [CAPC1005X55N]
C91  30pF  [CAPC1005X55N]
IC11  LAN8742A-CZ-TR  [QFN24_0R5_4X4]
L7  600R@100MHz  [INDC1005X55N]
Q2  25MHz  [XTAL_ABRACON_ABLS]
R42  10k  [RESC1005X40N]
R43  10k  [RESC1005X40N]
R44  10k  [RESC1005X40N]
R45  33  [RESC1005X40N]
R46  33  [RESC1005X40N]
R47  10k  [RESC1005X40N]
R49  12k1  [RESC1005X40N]
R50  33  [RESC1005X40N]
R55  10k  [RESC1005X40N]
R60  33  [RESC1005X40N]
R98  1k5  [RESC1005X40N]
R99  10k  [RESC1005X40N]
R198  10k  [RESC1005X40N]

### Ports
ETH_PHY_NRST (in), LED1 (out), LED2 (out), PHY_RD_N (bidir), PHY_RD_P (bidir), PHY_TD_N (bidir), PHY_TD_P (bidir), RMII_CRS_DV (out), RMII_MDC (in), RMII_MDIO (bidir), RMII_REF_CLK (out), RMII_RXD0 (out), RMII_RXD1 (out), RMII_TX_EN (in), RMII_TXD0 (in), RMII_TXD1 (in)

### Nets
AVDDT_PHY: C52.1 C81.2 C85.2 C88.2 IC11.1(VDD2A) IC11.19(VDD1A) L7.1
GND: C52.2 C81.1 C82.1 C83.1 C84.1 C85.1 C87.1 C88.1 C91.1 IC11.25(GND_EP) R47.2 R49.2 R55.2 R198.1
P3V3: C84.2 IC11.9(VDDIO) L7.2 R42.1 R43.1 R44.1 R98.1 R99.1
ETH_PHY_NRST: IC11.15(nRST) R198.2 ; port ETH_PHY_NRST
LED1: IC11.2(LED2/nINT/nPME/nINTSEL) R55.1 ; port LED1
LED2: IC11.3(LED1/nINT/nPME/REGOFF) ; port LED2
PHY_RD_N: IC11.22(RXN) ; port PHY_RD_N
PHY_RD_P: IC11.23(RXP) ; port PHY_RD_P
PHY_TD_N: IC11.20(TXN) ; port PHY_TD_N
PHY_TD_P: IC11.21(TXP) ; port PHY_TD_P
NetC82_2: C82.2 IC11.4(XTAL2) Q2.2(OSC2)
NetC83_2: C83.2 C87.2 IC11.6(VDDCR)
NetC91_2: C91.2 IC11.5(XTAL1/CLKIN) Q2.1(OSC1)
NetIC9_27: IC11.13(MDC) ; port RMII_MDC
NetIC9_35: R60.1 ; port RMII_REF_CLK
NetIC9_36: IC11.12(MDIO) R98.2 ; port RMII_MDIO
NetIC9_43: R50.1 ; port RMII_CRS_DV
NetIC9_44: R45.1 ; port RMII_RXD0
NetIC9_45: R46.1 ; port RMII_RXD1
NetIC9_70: IC11.16(TXEN) ; port RMII_TX_EN
NetIC9_74: IC11.18(TXD1) ; port RMII_TXD1
NetIC9_128: IC11.17(TXD0) ; port RMII_TXD0
NetIC11_7: IC11.7(RXD1/MODE1) R43.2 R46.2
NetIC11_8: IC11.8(RXD0/MODE0) R42.2 R45.2
NetIC11_10: IC11.10(RXER/PHYAD0) R47.1
NetIC11_11: IC11.11(CRS_DV/MODE2) R44.2 R50.2
NetIC11_14: IC11.14(nINT/REFCLK0) R60.2 R99.2
NetIC11_24: IC11.24(RBIAS) R49.1

### Layout directives
differential pair: PHY_RD_N, PHY_RD_P, PHY_TD_N, PHY_TD_P
mark named Diff Pair 100ohm: PHY_RD_N, PHY_RD_P, PHY_TD_N, PHY_TD_P

### Notes on the sheet
- PG11
- PG13
- PB13
- PC4
- PC5
- PA7
- PC1
- PA2
- PA1
- common mode >=2.5V
  replace with common mode 0-1.8V
  OR
  replace muxing switch with one using 3.3V CM
- Project/Equipment
- Document
- Designer
- Drawn by
- Check.by
- Copyright WUT =Copy(CurrentDate,7,4)
  This document describes Open Hardware and is licensed under the CERN-OHL-W v2
  You may redistribute and modify this documentation and make products using it under the terms of the CERN-OHL-W v2 (https:/cern.ch/cern-ohl). This documentation is distributed WITHOUT ANY EXPRESS OR IMPLIED WARRANTY, INCLUDING OF MERCHANTABILITY, SATISFACTORY QUALITY AND FITNESS FOR A PARTICULAR PURPOSE. Please see the CERN-OHL-W v2 for applicable conditions.
  Source location: =SourceLocation
  As per CERN-OHL-W v2 section 4, should You produce hardware based on these sources, You must maintain the Source Location visible on the silkscreen or top copper for a =Title1 PCB or other product you make using this documentation.
- Contact:
- File
- Last Mod.
- Print Date
- Sheet
- Size
- A3
- of
- Rev
- (in symbol CTE3216-18_10UF_16V_20%_AVX_TCJ) +
- (in symbol R0402_1K5_1%_0.0625W_100PPM) 1%
- (in symbol R0402_10K_1%_0.0625W_100PPM) 1%
- (in symbol R0402_12K1_1%_0.0625W_100PPM) 1%
- (in symbol R0402_33R_1%_0.0625W_100PPM) 1%

### Library data of the parts
C52 = CTE3216-18_10UF_16V_20%_AVX_TCJ: Polarised capacitor; Part Description: ESR 0R200 Tantalum Solid Electrolytic Chip Capacitor with Conductive Polymer Electrode; Manufacturer: AVX; Manufacturer Part Number: TCJA106M016R0200; Voltage: 16V; Tolerance: ±20%; Part Number: CTE3216-18_10UF_16V_20%_AVX_TCJ; Component Kind: Standard; Component Type: Standard; Pin Count: 2; Value: 10uF; Status: Preferred; Case: A; Mounted: Yes; Socket: No; SMD: Yes; Sense: No; ComponentHeight: 1.8mm; HelpURL: \\cern.ch\dfs\Applications\Altium\Datasheets\CTE_AVX_TCJ.pdf; Author: CERN DEM JLC; CreateDate: 29.03.2012; LatestRevisionDate: 29.03.2012
C81 C84 C85 C88 = CC0402_100NF_16V_10%_X5R: as C79 on sheet Ethernet; Value: 100nF; Part Number: CC0402_100NF_16V_10%_X5R; Component Kind: Standard; Component Type: Standard; Pin Count: 2; Status: None; Manufacturer Part Number: CC0402_100NF_16V_10%_X5R; Case: 0402; Mounted: Yes; Socket: No; SMD: Yes; Sense: No; Manufacturer1 Example: MURATA; Manufacturer1 ComponentHeight: 0.55mm; HelpURL: \\cern.ch\dfs\Applications\Altium\Datasheets\CC0402_X5R_MURATA_GRM.pdf; Author: CERN DEM JLC; CreateDate: 10/12/2013; LatestRevisionDate: 10/12/2013
C82 C91 = CC0402_30PF_50V_1%_C0G_MURATA_GJM1555C1H300FB01: Non-polarised capacitor; Part Description: High-Q SMD Chip Monolithic Ceramic Capacitor; Manufacturer: MURATA; Manufacturer Part Number: GJM1555C1H300FB01D; Voltage: 50V; TC: C0G/NP0; Tolerance: ±1%; Part Number: CC0402_30PF_50V_1%_C0G_MURATA_GJM1555C1H300FB01; Component Kind: Standard; Component Type: Standard; Pin Count: 2; Value: 30pF; Status: Not Recommended; Case: 0402; Mounted: Yes; Socket: No; SMD: Yes; Sense: No; ComponentHeight: 0.55mm; HelpURL: \\cern.ch\dfs\Applications\Altium\Datasheets\CC0402_MURATA_GJM1555C1H300FB01D.pdf; Author: CERN DEM BC; CreateDate: 20/11/2017; LatestRevisionDate: 20/11/2017
C83 = CC0402_1NF_50V_10%_X7R: Non-polarised capacitor; Part Description: SMD Multilayer Chip Ceramic Capacitor; Manufacturer: GENERIC; Manufacturer1 Part Number: 223858715623; Voltage: 50V; TC: X7R; Tolerance: ±10%; Part Number: CC0402_1NF_50V_10%_X7R; Component Kind: Standard; Component Type: Standard; Pin Count: 2; Value: 1nF; Status: Not Recommended; Manufacturer Part Number: CC0402_1NF_50V_10%_X7R; Case: 0402; Mounted: Yes; Socket: No; SMD: Yes; Sense: No; Manufacturer1 Example: PHYCOMP; Manufacturer1 ComponentHeight: 0.55mm; HelpURL: \\cern.ch\dfs\Applications\Altium\Datasheets\CC0402_X7R_PHYCOMP.pdf; Author: CERN DEM JLC; CreateDate: 03/12/2007; LatestRevisionDate: 03/12/2007
C87 = CC0603_1UF_16V_10%_X7R: Non-polarised capacitor; Part Description: SMD Multilayer Chip Ceramic Capacitor; Manufacturer: GENERIC; Manufacturer1 Part Number: 223878615663; Voltage: 16V; TC: X7R; Tolerance: ±10%; Part Number: CC0603_1UF_16V_10%_X7R; Component Kind: Standard; Component Type: Standard; Pin Count: 2; Value: 1uF; Status: None; Manufacturer Part Number: CC0603_1uF_16V_10%_X7R; Case: 0603; Mounted: Yes; Socket: No; SMD: Yes; Sense: No; Manufacturer1 Example: YAGEO PHYCOMP; Manufacturer1 ComponentHeight: 0.9mm; HelpURL: \\cern.ch\dfs\Applications\Altium\Datasheets\CC0603_X7R_PHYCOMP.pdf; Author: CERN DEM JLC; CreateDate: 03/12/2007; LatestRevisionDate: 17/04/2015
IC11 = IFC_LAN8742A: LAN8742A-CZ-TR - Small Footprint RMII 10/100 Ethernet, Transceiver with HP Auto-MDIX and flexPWR Technology SQFN-24; Manufacturer: MICROCHIP; Order: LAN8742A-CZ-TR; Manufacturer Part Number: LAN8742A-CZ-TR; Distrib: MICROCHIP
L7 = IND0402_MURATA_BLM15HD601SN1: Inductor; Part Description: SMD EMIFIL Suppression Chip Ferrite Bead; Manufacturer: MURATA; Manufacturer Part Number: BLM15HD601SN1D; Power: 300mA; Resistance: 0.85R; Tolerance: ±25%; Part Number: IND0402_MURATA_BLM15HD601SN1; Component Kind: Standard; Component Type: Standard; Pin Count: 2; Value: 600R@100MHz; Status: None; Case: 0402; Mounted: Yes; Socket: No; SMD: Yes; Sense: No; ComponentHeight: 0.55mm; HelpURL: \\cern.ch\dfs\Applications\Altium\Datasheets\IND0402_MURATA_BLM15H.pdf; Author: CERN DEM JLC; CreateDate: 28/02/2012; LatestRevisionDate: 28/02/2012
Q2 = XTAL_25MHZ_ABRACON_ABLS-25.000MHZ-B2F-T: Quartz Crystal; Part Description: Tolerance: ± 20ppm, Stability: ± 50ppm, -20°C to +70°C, 18pF, 40 Ohms ESR, Low Profile Surface Mount Microprocessor Crystal, ABLS Series; PressFit: No; Bonding: No; Part Number: XTAL_25MHZ_ABRACON_ABLS-25.000MHZ-B2F-T; Component Kind: Standard; Component Type: Standard; PackageDescription: SMD Crystal, Body 11.40mm L X 4.70mm W X 4.20mm H, HC/49US (AT49) ALBS Series; Value: 25MHz; Manufacturer: ABRACON; Manufacturer Part Number: ABLS-25.000MHZ-B2F-T; Pin Count: 2; Mounted: Yes; Socket: No; SMD: Yes; Sense: No; ComponentHeight: 4.2mm; HelpURL: \\cern.ch\dfs\Applications\Altium\Datasheets\XTAL_ABRACON_ABLS.pdf; Author: CERN DEM JLC; CreateDate: 03/06/2010; LatestRevisionDate: 15/02/2018
R42-R44 R47 R55 R99 R198 = R0402_10K_1%_0.0625W_100PPM: Resistor - 1%; Part Description: General Purpose Thick Film Chip Resistor; Manufacturer: GENERIC; Manufacturer1 Part Number: 232270671003L; TC: ±100ppm/°C; PressFit: No; Value: 10k; Part Number: R0402_10K_1%_0.0625W_100PPM; Component Kind: Standard; Component Type: Standard; Pin Count: 2; Status: Not Recommended; Power: 0.0625W; Tolerance: ±1%; Manufacturer Part Number: R0402_10K_1%_0.0625W_100PPM; Case: 0402; Mounted: Yes; Sense: No; Socket: No; SMD: Yes; Manufacturer1 Example: YAGEO PHYCOMP; Manufacturer1 ComponentHeight: 0.4mm; HelpURL: \\cern.ch\dfs\Applications\Altium\Datasheets\R0402_Phycomp_RC0402.pdf; Author: CERN DEM JLC; CreateDate: 03/12/2007; LatestRevisionDate: 17/10/2012
R45 R46 R50 R60 = R0402_33R_1%_0.0625W_100PPM: Resistor - 1%; Part Description: General Purpose Thick Film Chip Resistor; Manufacturer: GENERIC; Manufacturer1 Part Number: 232270673309L; TC: ±100ppm/°C; PressFit: No; Part Number: R0402_33R_1%_0.0625W_100PPM; Component Kind: Standard; Component Type: Standard; Pin Count: 2; Value: 33; Status: Not Recommended; Power: 0.0625W; Tolerance: ±1%; Manufacturer Part Number: R0402_33R_1%_0.0625W_100PPM; Case: 0402; Mounted: Yes; Sense: No; Socket: No; SMD: Yes; Manufacturer1 Example: YAGEO PHYCOMP; Manufacturer1 ComponentHeight: 0.4mm; HelpURL: \\cern.ch\dfs\Applications\Altium\Datasheets\R0402_Phycomp_RC0402.pdf; Author: CERN DEM JLC; CreateDate: 03/12/2007; LatestRevisionDate: 17/10/2012
R49 = R0402_12K1_1%_0.0625W_100PPM: Resistor - 1%; Part Description: General Purpose Thick Film Chip Resistor; Manufacturer: GENERIC; Manufacturer1 Part Number: 232270671213L or RC0402FR-0712K1L; TC: ±100ppm/°C; PressFit: No; Part Number: R0402_12K1_1%_0.0625W_100PPM; Component Kind: Standard; Component Type: Standard; Pin Count: 2; Value: 12k1; Status: Not Recommended; Power: 0.0625W; Tolerance: ±1%; Manufacturer Part Number: R0402_12K1_1%_0.0625W_100PPM; Case: 0402; Mounted: Yes; Sense: No; Socket: No; SMD: Yes; Manufacturer1 Example: YAGEO PHYCOMP; Manufacturer1 ComponentHeight: 0.4mm; HelpURL: \\cern.ch\dfs\Applications\Altium\Datasheets\R0402_Phycomp_RC0402.pdf; Author: CERN DEM JLC; CreateDate: 24/10/2012; LatestRevisionDate: 24/10/2012
R98 = R0402_1K5_1%_0.0625W_100PPM: as R243 on sheet ST_SYS_Board_Clocking; Part Number: R0402_1K5_1%_0.0625W_100PPM; Component Kind: Standard; Component Type: Standard; Pin Count: 2; Value: 1k5; Status: Not Recommended; Power: 0.0625W; Tolerance: ±1%; Manufacturer Part Number: R0402_1K5_1%_0.0625W_100PPM; Case: 0402; Mounted: Yes; Sense: No; Socket: No; SMD: Yes; Manufacturer1 Example: YAGEO PHYCOMP; Manufacturer1 ComponentHeight: 0.4mm; HelpURL: \\cern.ch\dfs\Applications\Altium\Datasheets\R0402_Phycomp_RC0402.pdf; Author: CERN DEM JLC; CreateDate: 03/12/2007; LatestRevisionDate: 17/10/2012

## Sheet USB_ETH_Mux.SchDoc: STM32 System Board
size 420 x 297 mm; Author: G.Kasprowicz, P. Kulik; CompanyName: WUT ISE; DrawnBy: G.Kasprowicz, P. Kulik; Organization: WUT ISE; DocumentNumber: 4; SheetNumber: 4; ModifiedBy: -; CheckedDate: -; Title2: STM32 CPU; Designer: G.Kasprowicz, P. Kulik; ModifiedDate: -; ProjectName: Sensor Box
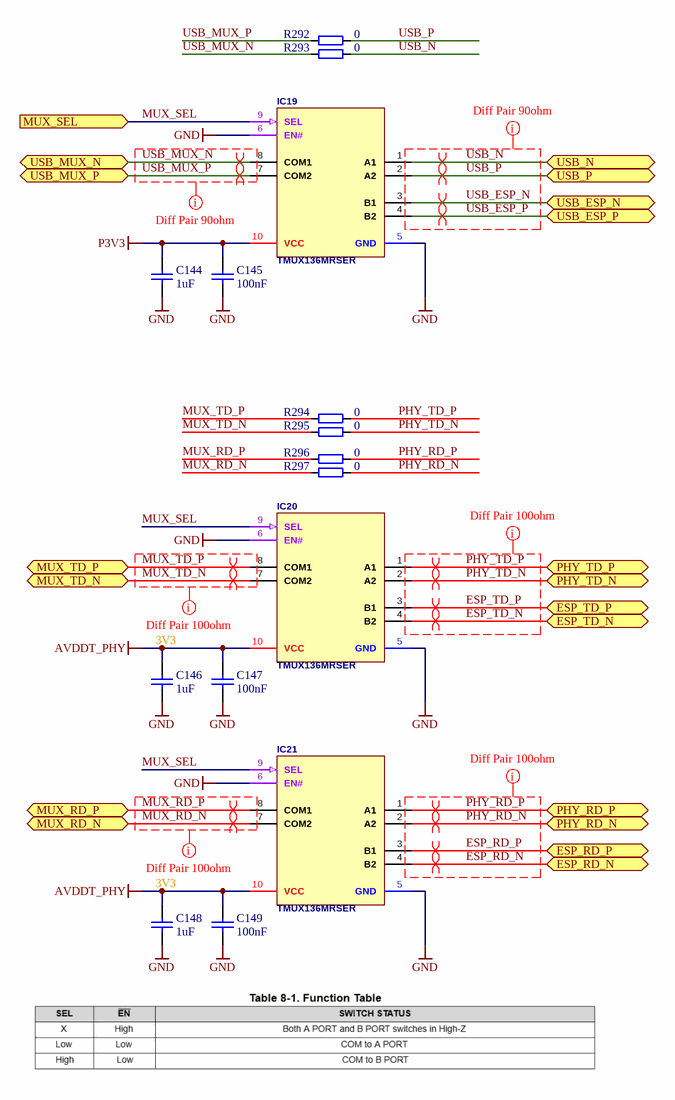
[diagram p13: USB_ETH_Mux.SchDoc]

### Parts
C144  1uF  [CAPC1005X55N]
C145  100nF  [CAPC1005X55N]
C146  1uF  [CAPC1005X55N]
C147  100nF  [CAPC1005X55N]
C148  1uF  [CAPC1005X55N]
C149  100nF  [CAPC1005X55N]
IC19  TMUX136MRSER  [TI_RSE0010A]
IC20  TMUX136MRSER  [TI_RSE0010A]
IC21  TMUX136MRSER  [TI_RSE0010A]
R292  0  [RESC1005X40N]
R293  0  [RESC1005X40N]
R294  0  [RESC1005X40N]
R295  0  [RESC1005X40N]
R296  0  [RESC1005X40N]
R297  0  [RESC1005X40N]

### Ports
ESP_RD_N (bidir), ESP_RD_P (bidir), ESP_TD_N (bidir), ESP_TD_P (bidir), MUX_RD_N (bidir), MUX_RD_P (bidir), MUX_SEL (in), MUX_TD_N (bidir), MUX_TD_P (bidir), PHY_RD_N (bidir), PHY_RD_P (bidir), PHY_TD_N (bidir), PHY_TD_P (bidir), USB_ESP_N (bidir), USB_ESP_P (bidir), USB_MUX_N (bidir), USB_MUX_P (bidir), USB_N (bidir), USB_P (bidir)

### Nets
AVDDT_PHY: C146.2 C147.1 C148.2 C149.1 IC20.10(VCC) IC21.10(VCC)
GND: C144.1 C145.2 C146.1 C147.2 C148.1 C149.2 IC19.5(GND) IC19.6(EN#) IC20.5(GND) IC20.6(EN#) IC21.5(GND) IC21.6(EN#)
P3V3: C144.2 C145.1 IC19.10(VCC)
ESP_RD_N: IC21.4(B2) ; port ESP_RD_N
ESP_RD_P: IC21.3(B1) ; port ESP_RD_P
ESP_TD_N: IC20.4(B2) ; port ESP_TD_N
ESP_TD_P: IC20.3(B1) ; port ESP_TD_P
MUX_RD_N: IC21.7(COM2) R297.1 ; port MUX_RD_N
MUX_RD_P: IC21.8(COM1) R296.1 ; port MUX_RD_P
MUX_SEL: IC19.9(SEL) IC20.9(SEL) IC21.9(SEL) ; port MUX_SEL
MUX_TD_N: IC20.7(COM2) R295.1 ; port MUX_TD_N
MUX_TD_P: IC20.8(COM1) R294.1 ; port MUX_TD_P
PHY_RD_N: IC21.2(A2) R297.2 ; port PHY_RD_N
PHY_RD_P: IC21.1(A1) R296.2 ; port PHY_RD_P
PHY_TD_N: IC20.2(A2) R295.2 ; port PHY_TD_N
PHY_TD_P: IC20.1(A1) R294.2 ; port PHY_TD_P
USB_ESP_N: IC19.3(B1) ; port USB_ESP_N
USB_ESP_P: IC19.4(B2) ; port USB_ESP_P
USB_MUX_N: IC19.8(COM1) R293.1 ; port USB_MUX_N
USB_MUX_P: IC19.7(COM2) R292.1 ; port USB_MUX_P
USB_N: IC19.1(A1) R293.2 ; port USB_N
USB_P: IC19.2(A2) R292.2 ; port USB_P

### Layout directives
mark named Diff Pair 90ohm: USB_ESP_N, USB_ESP_P, USB_MUX_N, USB_MUX_P, USB_N, USB_P
differential pair: ESP_RD_N, ESP_RD_P, ESP_TD_N, ESP_TD_P, MUX_RD_N, MUX_RD_P, MUX_TD_N, MUX_TD_P, PHY_RD_N, PHY_RD_P, PHY_TD_N, PHY_TD_P, USB_ESP_N, USB_ESP_P, USB_MUX_N, USB_MUX_P, USB_N, USB_P
mark named Diff Pair 100ohm: ESP_RD_N, ESP_RD_P, ESP_TD_N, ESP_TD_P, MUX_RD_N, MUX_RD_P, MUX_TD_N, MUX_TD_P, PHY_RD_N, PHY_RD_P, PHY_TD_N, PHY_TD_P

### Notes on the sheet
- (near C146) 3V3
- (near C148) 3V3
- Project/Equipment
- Document
- Designer
- Drawn by
- Check.by
- Copyright WUT =Copy(CurrentDate,7,4)
  This document describes Open Hardware and is licensed under the CERN-OHL-W v2
  You may redistribute and modify this documentation and make products using it under the terms of the CERN-OHL-W v2 (https:/cern.ch/cern-ohl). This documentation is distributed WITHOUT ANY EXPRESS OR IMPLIED WARRANTY, INCLUDING OF MERCHANTABILITY, SATISFACTORY QUALITY AND FITNESS FOR A PARTICULAR PURPOSE. Please see the CERN-OHL-W v2 for applicable conditions.
  Source location: =SourceLocation
  As per CERN-OHL-W v2 section 4, should You produce hardware based on these sources, You must maintain the Source Location visible on the silkscreen or top copper for a =Title1 PCB or other product you make using this documentation.
- Contact:
- File
- Last Mod.
- Print Date
- Sheet
- Size
- A3
- of
- Rev

### Library data of the parts
C144 C146 C148 = CC0402_1UF_16V_10%_X5R: Non-polarised capacitor; Part Description: SMD Multilayer Chip Ceramic Capacitor; Manufacturer: GENERIC; Manufacturer1 Part Number: C1005X5R1C105KT; Voltage: 16V; TC: X5R; Tolerance: ±10%; Part Number: CC0402_1UF_16V_10%_X5R; Component Kind: Standard; Component Type: Standard; Pin Count: 2; Value: 1uF; Status: Preferred; Manufacturer Part Number: CC0402_1UF_16V_10%_X5R; Case: 0402; Mounted: Yes; Socket: No; SMD: Yes; Sense: No; Manufacturer1 Example: TDK; Manufacturer1 ComponentHeight: 0.55mm; HelpURL: \\cern.ch\dfs\Applications\Altium\Datasheets\CC0402_X5R_TDK_C.pdf; Author: CERN DEM JLC; CreateDate: 2012-10-25; LatestRevisionDate: 2012-10-25
C145 C147 C149 = CC0402_100NF_16V_10%_X5R: as C79 on sheet Ethernet; Value: 100nF; Part Number: CC0402_100NF_16V_10%_X5R; Component Kind: Standard; Component Type: Standard; Pin Count: 2; Status: None; Manufacturer Part Number: CC0402_100NF_16V_10%_X5R; Case: 0402; Mounted: Yes; Socket: No; SMD: Yes; Sense: No; Manufacturer1 Example: MURATA; Manufacturer1 ComponentHeight: 0.55mm; HelpURL: \\cern.ch\dfs\Applications\Altium\Datasheets\CC0402_X5R_MURATA_GRM.pdf; Author: CERN DEM JLC; CreateDate: 10/12/2013; LatestRevisionDate: 10/12/2013
IC19-IC21 = TMUX136: Two-Channel Differential 2:1 MUX or 1:2 Demux; Manufacturer: Texas Instruments; Manufacturer Part Number: TMUX136MRSER
R292-R297 = R0402_0R_JUMPER: as R283 on sheet ST_SYS_Board_Clocking; Part Number: R0402_0R_JUMPER; Component Kind: Standard; Component Type: Standard; Pin Count: 2; Value: 0; Status: Not Recommended; Manufacturer Part Number: R0402_0R_JUMPER; Case: 0402; Mounted: Yes; Sense: No; Socket: No; SMD: Yes; Manufacturer1 Example: YAGEO PHYCOMP; Manufacturer1 ComponentHeight: 0.4mm; HelpURL: \\cern.ch\dfs\Applications\Altium\Datasheets\R0402_Phycomp_RC0402.pdf; Author: CERN DEM JLC; CreateDate: 03/12/2007; LatestRevisionDate: 17/10/2012